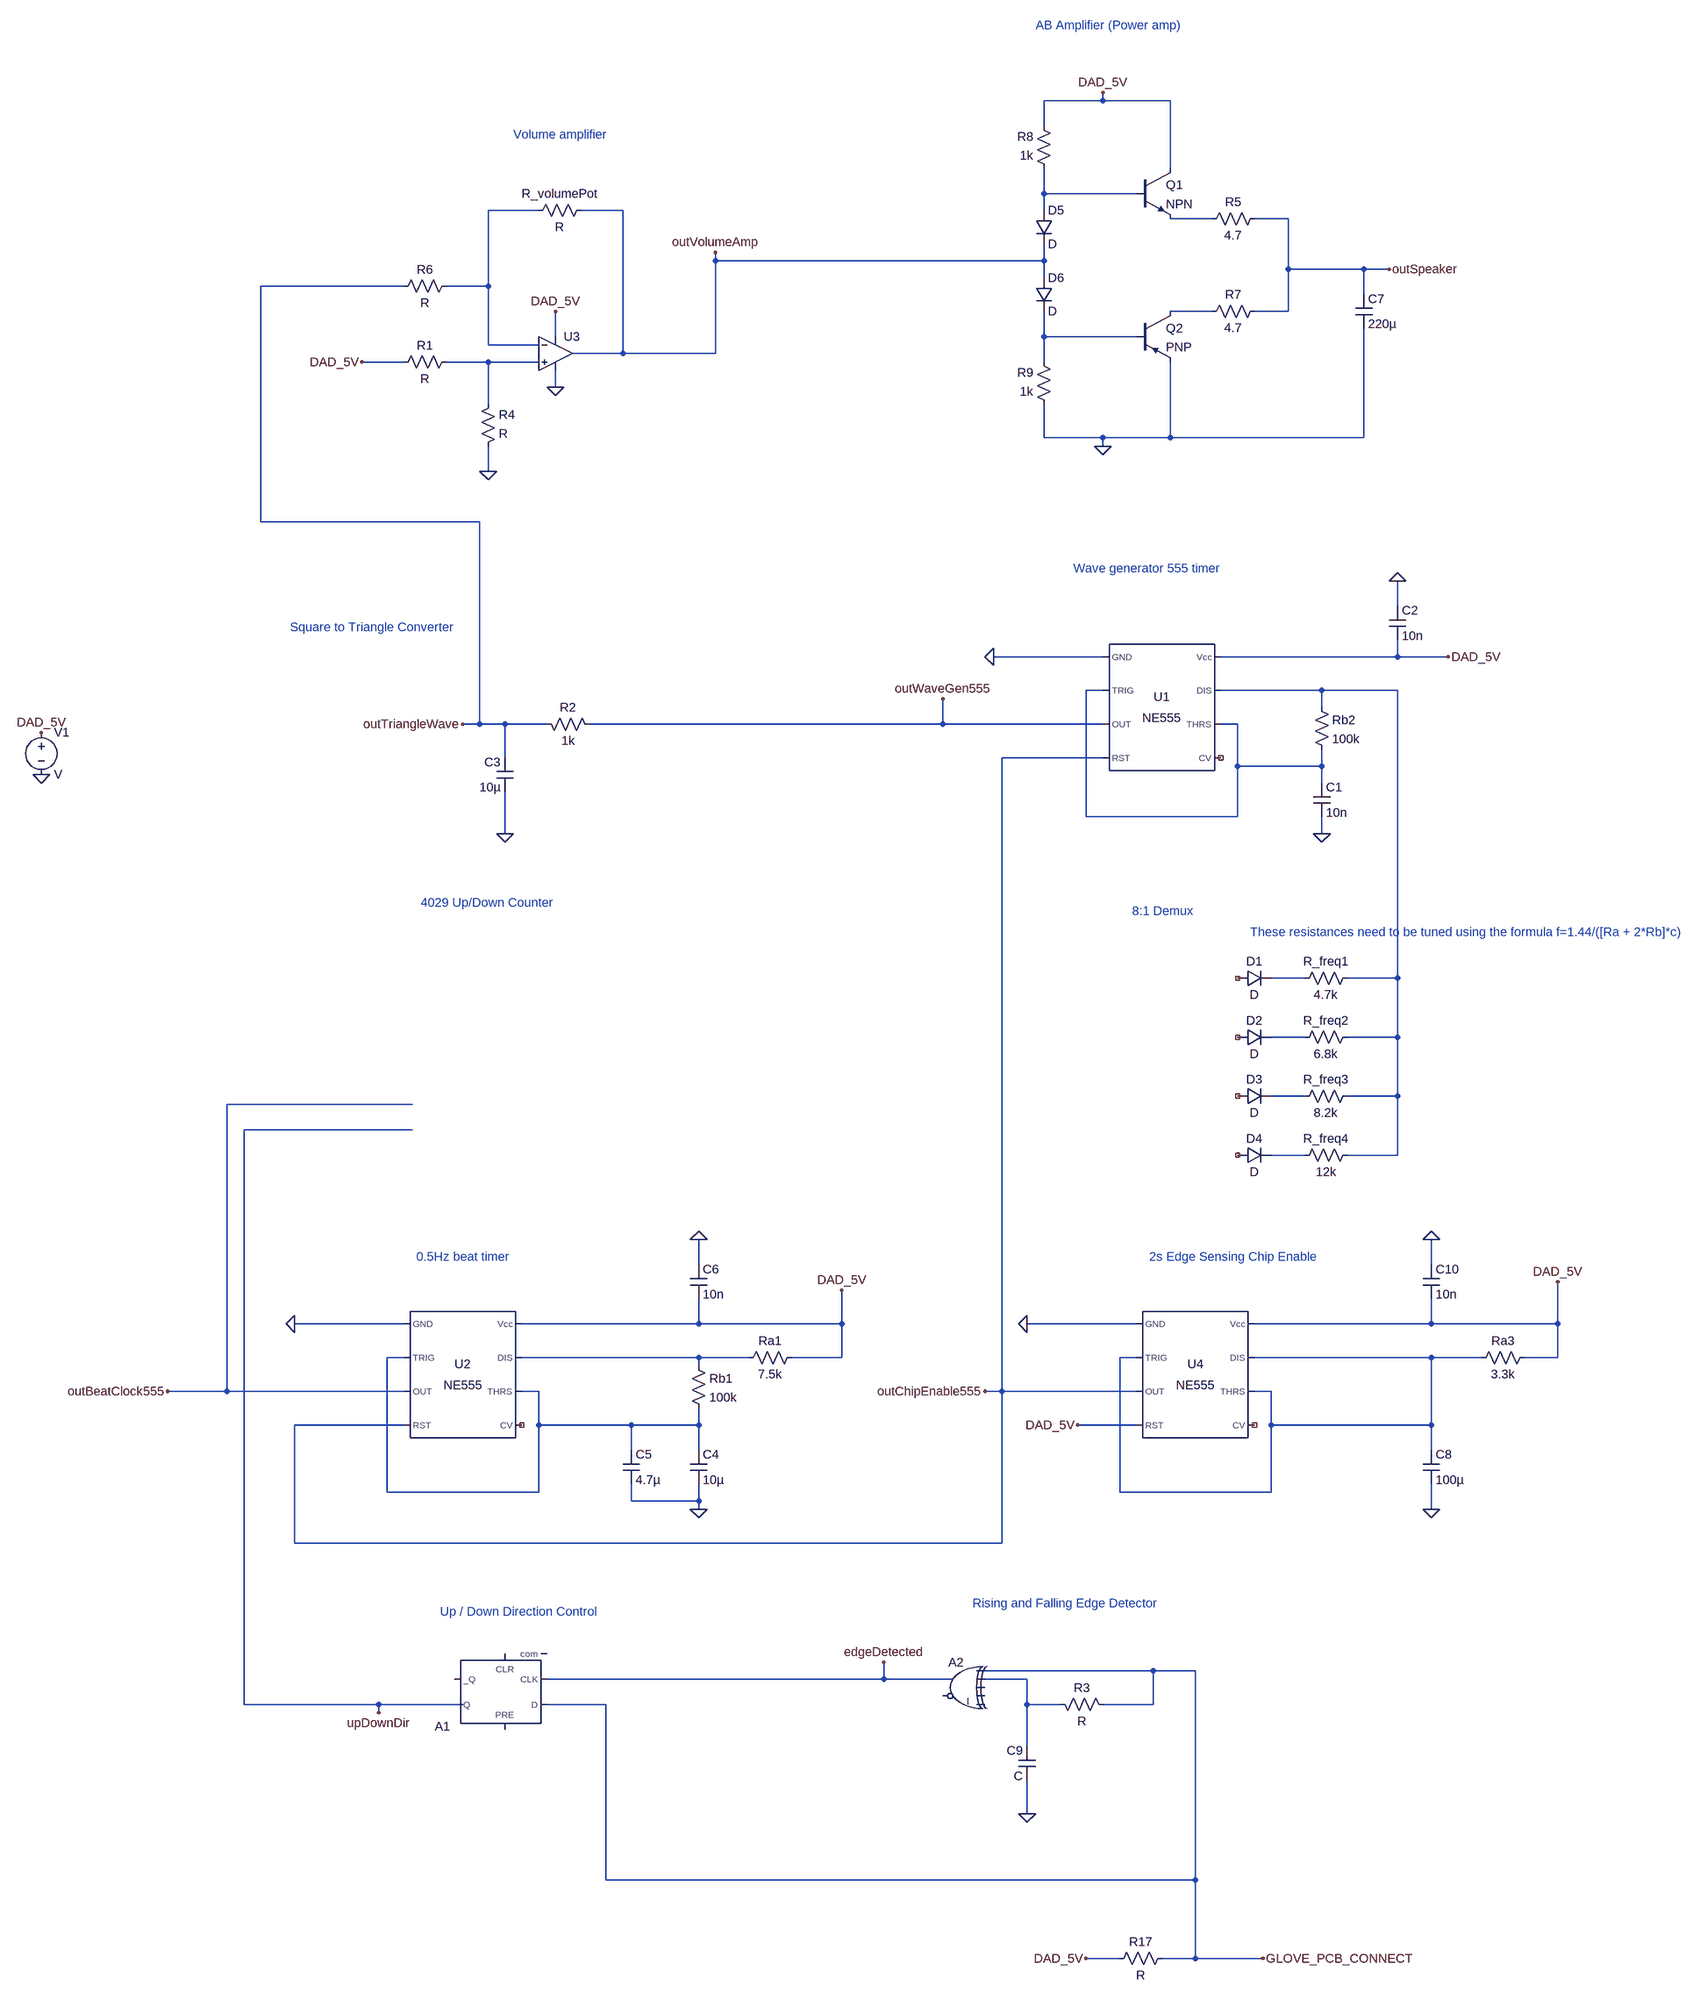
[diagram p0: schematic Wavegen and AB Amp.asc]
Wavegen and AB Amp.asc, the LTspice schematic file:
Version 4
SHEET 1 4340 4428
WIRE 1456 -1008 1456 -1024
WIRE 1456 -1008 1344 -1008
WIRE 1584 -1008 1456 -1008
WIRE 1344 -960 1344 -1008
WIRE 1584 -880 1584 -1008
WIRE 1344 -832 1344 -880
WIRE 1520 -832 1344 -832
WIRE 384 -800 288 -800
WIRE 544 -800 464 -800
WIRE 1344 -800 1344 -832
WIRE 1664 -784 1584 -784
WIRE 1808 -784 1744 -784
WIRE 720 -704 720 -720
WIRE 1344 -704 1344 -736
WIRE 1344 -704 720 -704
WIRE 1808 -688 1808 -784
WIRE 1952 -688 1808 -688
WIRE 2000 -688 1952 -688
WIRE 1344 -672 1344 -704
WIRE 128 -656 -144 -656
WIRE 288 -656 288 -800
WIRE 288 -656 208 -656
WIRE 1952 -640 1952 -688
WIRE 1664 -608 1584 -608
WIRE 1808 -608 1808 -688
WIRE 1808 -608 1744 -608
WIRE 416 -560 416 -608
WIRE 1344 -560 1344 -608
WIRE 1520 -560 1344 -560
WIRE 288 -544 288 -656
WIRE 384 -544 288 -544
WIRE 544 -528 544 -800
WIRE 544 -528 448 -528
WIRE 720 -528 720 -704
WIRE 720 -528 544 -528
WIRE 128 -512 48 -512
WIRE 288 -512 208 -512
WIRE 384 -512 288 -512
WIRE 1344 -512 1344 -560
WIRE 416 -464 416 -496
WIRE 288 -432 288 -512
WIRE 1344 -368 1344 -432
WIRE 1456 -368 1344 -368
WIRE 1584 -368 1584 -512
WIRE 1584 -368 1456 -368
WIRE 1952 -368 1952 -576
WIRE 1952 -368 1584 -368
WIRE 1456 -352 1456 -368
WIRE 288 -304 288 -352
WIRE -144 -208 -144 -656
WIRE 272 -208 -144 -208
WIRE 2016 -48 2016 -96
WIRE 1456 48 1248 48
WIRE 2016 48 2016 16
WIRE 2016 48 1680 48
WIRE 2112 48 2016 48
WIRE 1456 112 1424 112
WIRE 1872 112 1680 112
WIRE 2016 112 1872 112
WIRE 1872 144 1872 112
WIRE 272 176 272 -208
WIRE 272 176 240 176
WIRE 320 176 272 176
WIRE 400 176 320 176
WIRE 1152 176 1152 128
WIRE 1152 176 480 176
WIRE 1456 176 1152 176
WIRE 1712 176 1680 176
WIRE 320 240 320 176
WIRE 1456 240 1264 240
WIRE 1712 256 1712 176
WIRE 1872 256 1872 224
WIRE 1872 256 1712 256
WIRE 1872 288 1872 256
WIRE 1424 352 1424 112
WIRE 1712 352 1712 256
WIRE 1712 352 1424 352
WIRE 320 384 320 304
WIRE 1872 384 1872 352
WIRE 1840 752 1776 752
WIRE 2016 752 2016 112
WIRE 2016 752 1920 752
WIRE 1840 864 1776 864
WIRE 2016 864 2016 752
WIRE 2016 864 1920 864
WIRE 1840 976 1776 976
WIRE 2016 976 2016 864
WIRE 2016 976 1920 976
WIRE 144 992 -208 992
WIRE 144 1040 -176 1040
WIRE 1840 1088 1776 1088
WIRE 2016 1088 2016 976
WIRE 2016 1088 1920 1088
WIRE 688 1360 688 1312
WIRE 2080 1360 2080 1312
WIRE 128 1472 -80 1472
WIRE 688 1472 688 1424
WIRE 688 1472 352 1472
WIRE 960 1472 960 1408
WIRE 960 1472 688 1472
WIRE 1520 1472 1312 1472
WIRE 2080 1472 2080 1424
WIRE 2080 1472 1744 1472
WIRE 2320 1472 2320 1392
WIRE 2320 1472 2080 1472
WIRE 128 1536 96 1536
WIRE 688 1536 352 1536
WIRE 784 1536 688 1536
WIRE 960 1536 960 1472
WIRE 960 1536 864 1536
WIRE 1520 1536 1488 1536
WIRE 2080 1536 1744 1536
WIRE 2176 1536 2080 1536
WIRE 2320 1536 2320 1472
WIRE 2320 1536 2256 1536
WIRE 688 1552 688 1536
WIRE -208 1600 -208 992
WIRE -208 1600 -336 1600
WIRE 128 1600 -208 1600
WIRE 384 1600 352 1600
WIRE 1264 1600 1264 240
WIRE 1264 1600 1232 1600
WIRE 1520 1600 1264 1600
WIRE 1776 1600 1744 1600
WIRE 128 1664 -80 1664
WIRE 384 1664 384 1600
WIRE 560 1664 384 1664
WIRE 688 1664 688 1632
WIRE 688 1664 560 1664
WIRE 1520 1664 1408 1664
WIRE 1776 1664 1776 1600
WIRE 2080 1664 2080 1536
WIRE 2080 1664 1776 1664
WIRE 560 1712 560 1664
WIRE 688 1712 688 1664
WIRE 2080 1712 2080 1664
WIRE 96 1792 96 1536
WIRE 384 1792 384 1664
WIRE 384 1792 96 1792
WIRE 1488 1792 1488 1536
WIRE 1776 1792 1776 1664
WIRE 1776 1792 1488 1792
WIRE 560 1808 560 1776
WIRE 688 1808 688 1776
WIRE 688 1808 560 1808
WIRE 688 1824 688 1808
WIRE 2080 1824 2080 1776
WIRE -80 1888 -80 1664
WIRE 1264 1888 1264 1600
WIRE 1264 1888 -80 1888
WIRE 1552 2224 1232 2224
WIRE 1632 2224 1552 2224
WIRE 1040 2240 1040 2208
WIRE 1040 2240 400 2240
WIRE 1168 2240 1040 2240
WIRE 1312 2240 1232 2240
WIRE -176 2288 -176 1040
WIRE 80 2288 -176 2288
WIRE 240 2288 80 2288
WIRE 512 2288 400 2288
WIRE 1312 2288 1312 2240
WIRE 1376 2288 1312 2288
WIRE 1552 2288 1552 2224
WIRE 1552 2288 1456 2288
WIRE 80 2304 80 2288
WIRE 1312 2368 1312 2288
WIRE 1312 2496 1312 2432
WIRE 512 2768 512 2288
WIRE 1632 2768 1632 2224
WIRE 1632 2768 512 2768
WIRE 1488 2944 1424 2944
WIRE 1632 2944 1632 2768
WIRE 1632 2944 1568 2944
WIRE 1760 2944 1632 2944
FLAG 1152 128 outWaveGen555
FLAG -576 272 0
FLAG -576 192 DAD_5V
FLAG 1248 48 0
FLAG 2112 48 DAD_5V
FLAG 2016 -96 0
FLAG 1872 384 0
FLAG 320 384 0
FLAG 240 176 outTriangleWave
FLAG 688 1824 0
FLAG -336 1600 outBeatClock555
FLAG -80 1472 0
FLAG 960 1408 DAD_5V
FLAG 688 1312 0
FLAG 416 -608 DAD_5V
FLAG 416 -464 0
FLAG 288 -304 0
FLAG 48 -512 DAD_5V
FLAG 720 -720 outVolumeAmp
FLAG 1456 -1024 DAD_5V
FLAG 1456 -352 0
FLAG 2000 -688 outSpeaker
FLAG 2080 1824 0
FLAG 1232 1600 outChipEnable555
FLAG 1312 1472 0
FLAG 2320 1392 DAD_5V
FLAG 2080 1312 0
FLAG 1408 1664 DAD_5V
FLAG 1424 2944 DAD_5V
FLAG 1760 2944 GLOVE_PCB_CONNECT
FLAG 80 2304 upDownDir
FLAG 1312 2496 0
FLAG 1040 2208 edgeDetected
SYMBOL Misc\\NE555 1568 144 R0
SYMATTR InstName U1
SYMBOL voltage -576 176 R0
SYMATTR InstName V1
SYMBOL res 1856 128 R0
SYMATTR InstName Rb2
SYMATTR Value 100k
SYMBOL cap 2000 -48 R0
SYMATTR InstName C2
SYMATTR Value 10n
SYMBOL cap 1856 288 R0
SYMATTR InstName C1
SYMATTR Value 10n
SYMBOL res 384 160 M90
WINDOW 0 0 56 VBottom 2
WINDOW 3 32 56 VTop 2
SYMATTR InstName R2
SYMATTR Value 1k
SYMBOL cap 336 240 M0
SYMATTR InstName C3
SYMATTR Value 10µ
SYMBOL res 1936 736 R90
WINDOW 0 0 56 VBottom 2
WINDOW 3 32 56 VTop 2
SYMATTR InstName R_freq1
SYMATTR Value 4.7k
SYMBOL res 1936 848 R90
WINDOW 0 0 56 VBottom 2
WINDOW 3 32 56 VTop 2
SYMATTR InstName R_freq2
SYMATTR Value 6.8k
SYMBOL res 1936 960 R90
WINDOW 0 0 56 VBottom 2
WINDOW 3 32 56 VTop 2
SYMATTR InstName R_freq3
SYMATTR Value 8.2k
SYMBOL res 1936 1072 R90
WINDOW 0 0 56 VBottom 2
WINDOW 3 32 56 VTop 2
SYMATTR InstName R_freq4
SYMATTR Value 12k
SYMBOL diode 1712 768 R270
WINDOW 0 32 32 VTop 2
WINDOW 3 0 32 VBottom 2
SYMATTR InstName D1
SYMBOL diode 1712 880 R270
WINDOW 0 32 32 VTop 2
WINDOW 3 0 32 VBottom 2
SYMATTR InstName D2
SYMBOL diode 1712 992 R270
WINDOW 0 32 32 VTop 2
WINDOW 3 0 32 VBottom 2
SYMATTR InstName D3
SYMBOL diode 1712 1104 R270
WINDOW 0 32 32 VTop 2
WINDOW 3 0 32 VBottom 2
SYMATTR InstName D4
SYMBOL Misc\\NE555 240 1568 R0
SYMATTR InstName U2
SYMBOL cap 672 1712 R0
SYMATTR InstName C4
SYMATTR Value 10µ
SYMBOL res 672 1536 R0
SYMATTR InstName Rb1
SYMATTR Value 100k
SYMBOL cap 544 1712 R0
SYMATTR InstName C5
SYMATTR Value 4.7µ
SYMBOL cap 672 1360 R0
SYMATTR InstName C6
SYMATTR Value 10n
SYMBOL OpAmps\\UniversalOpamp2 416 -528 R0
SYMATTR InstName U3
SYMBOL res 224 -528 R90
WINDOW 0 0 56 VBottom 2
WINDOW 3 32 56 VTop 2
SYMATTR InstName R1
SYMBOL res 272 -336 M180
WINDOW 0 36 76 Left 2
WINDOW 3 36 40 Left 2
SYMATTR InstName R4
SYMBOL res 480 -816 R90
WINDOW 0 0 56 VBottom 2
WINDOW 3 32 56 VTop 2
SYMATTR InstName R_volumePot
SYMBOL res 224 -672 R90
WINDOW 0 0 56 VBottom 2
WINDOW 3 32 56 VTop 2
SYMATTR InstName R6
SYMBOL npn 1520 -880 R0
SYMATTR InstName Q1
SYMBOL pnp 1520 -608 R0
SYMATTR InstName Q2
SYMBOL res 1760 -800 R90
WINDOW 0 0 56 VBottom 2
WINDOW 3 32 56 VTop 2
SYMATTR InstName R5
SYMATTR Value 4.7
SYMBOL res 1760 -624 R90
WINDOW 0 0 56 VBottom 2
WINDOW 3 32 56 VTop 2
SYMATTR InstName R7
SYMATTR Value 4.7
SYMBOL res 1360 -864 R180
WINDOW 0 36 76 Left 2
WINDOW 3 36 40 Left 2
SYMATTR InstName R8
SYMATTR Value 1k
SYMBOL res 1360 -416 R180
WINDOW 0 36 76 Left 2
WINDOW 3 36 40 Left 2
SYMATTR InstName R9
SYMATTR Value 1k
SYMBOL diode 1328 -800 R0
SYMATTR InstName D5
SYMBOL diode 1328 -672 R0
SYMATTR InstName D6
SYMBOL cap 1936 -640 R0
SYMATTR InstName C7
SYMATTR Value 220µ
SYMBOL Misc\\NE555 1632 1568 R0
SYMATTR InstName U4
SYMBOL cap 2064 1712 R0
SYMATTR InstName C8
SYMATTR Value 100µ
SYMBOL cap 2064 1360 R0
SYMATTR InstName C10
SYMATTR Value 10n
SYMBOL res 880 1520 R90
WINDOW 0 0 56 VBottom 2
WINDOW 3 32 56 VTop 2
SYMATTR InstName Ra1
SYMATTR Value 7.5k
SYMBOL res 2272 1520 R90
WINDOW 0 0 56 VBottom 2
WINDOW 3 32 56 VTop 2
SYMATTR InstName Ra3
SYMATTR Value 3.3k
SYMBOL res 1584 2928 R90
WINDOW 0 0 56 VBottom 2
WINDOW 3 32 56 VTop 2
SYMATTR InstName R17
SYMBOL Digital\\dflop 320 2336 R180
SYMATTR InstName A1
SYMBOL Digital\\xor 1184 2192 M0
SYMATTR InstName A2
SYMBOL res 1360 2272 M90
WINDOW 0 0 56 VBottom 2
WINDOW 3 32 56 VTop 2
SYMATTR InstName R3
SYMBOL cap 1328 2368 M0
SYMATTR InstName C9
TEXT 1400 -120 Left 2 ;Wave generator 555 timer
TEXT -88 -8 Left 2 ;Square to Triangle Converter
TEXT 152 1344 Left 2 ;0.5Hz beat timer
TEXT 1736 664 Left 2 ;These resistances need to be tuned using the formula f=1.44/([Ra + 2*Rb]*c)
TEXT 1512 624 Left 2 ;8:1 Demux
TEXT 160 608 Left 2 ;4029 Up/Down Counter
TEXT 336 -944 Left 2 ;Volume amplifier
TEXT 1328 -1152 Left 2 ;AB Amplifier (Power amp)
TEXT 1544 1344 Left 2 ;2s Edge Sensing Chip Enable
TEXT 496 2112 Right 2 ;Up / Down Direction Control
TEXT 1208 2096 Left 2 ;Rising and Falling Edge Detector

The netlist it stands for:
* Wavegen and AB Amp.asc
XU1 0 N007 outWaveGen555 outChipEnable555 NC_01 N007 N008 DAD_5V NE555  ; pins GND TRIG OUT RST CV THRS DIS Vcc
V1 DAD_5V 0 V
Rb2 N008 N007 100k
C2 0 DAD_5V 10n
C1 N007 0 10n
R2 outTriangleWave outWaveGen555 1k
C3 outTriangleWave 0 10µ
R_freq1 N008 N009 4.7k
R_freq2 N008 N010 6.8k
R_freq3 N008 N011 8.2k
R_freq4 N008 N012 12k
D1 NC_02 N009 D
D2 NC_03 N010 D
D3 NC_04 N011 D
D4 NC_05 N012 D
XU2 0 N013 outBeatClock555 outChipEnable555 NC_06 N013 N014 DAD_5V NE555  ; pins GND TRIG OUT RST CV THRS DIS Vcc
C4 N013 0 10µ
Rb1 N014 N013 100k
C5 N013 0 4.7µ
C6 0 DAD_5V 10n
XU3 N006 N002 DAD_5V 0 outVolumeAmp level.2 Avol=1Meg GBW=10Meg Slew=10Meg ilimit=25m rail=0 Vos=0 phimargin=45 en=0 enk=0 in=0 ink=0 Rin=500Meg  ; pins IN+ IN- V+ V- OUT
R1 N006 DAD_5V R
R4 0 N006 R
R_volumePot outVolumeAmp N002 R
R6 N002 outTriangleWave R
Q1 DAD_5V N001 N003 0 NPN
Q2 N004 N005 0 0 PNP
R5 outSpeaker N003 4.7
R7 outSpeaker N004 4.7
R8 N001 DAD_5V 1k
R9 0 N005 1k
D5 N001 outVolumeAmp D
D6 outVolumeAmp N005 D
C7 outSpeaker 0 220µ
XU4 0 N015 outChipEnable555 DAD_5V NC_07 N015 N015 DAD_5V NE555  ; pins GND TRIG OUT RST CV THRS DIS Vcc
C8 N015 0 100µ
C10 0 DAD_5V 10n
Ra1 DAD_5V N014 7.5k
Ra3 DAD_5V N015 3.3k
R17 GLOVE_PCB_CONNECT DAD_5V R
A1 GLOVE_PCB_CONNECT 0 edgeDetected 0 0 0 upDownDir 0 DFLOP
A2 GLOVE_PCB_CONNECT N016 0 0 0 0 edgeDetected 0 XOR
R3 N016 GLOVE_PCB_CONNECT R
C9 N016 0 C
.model D D
.lib standard.dio
.model NPN NPN
.model PNP PNP
.lib standard.bjt
* Wave generator 555 timer
* Square to Triangle Converter
* 0.5Hz beat timer
* These resistances need to be tuned using the formula f=1.44/([Ra + 2*Rb]*c)
* 8:1 Demux
* 4029 Up/Down Counter
* Volume amplifier
* AB Amplifier (Power amp)
* 2s Edge Sensing Chip Enable
* Up / Down Direction Control
* Rising and Falling Edge Detector
.lib NE555.sub
.lib UniversalOpamps2.sub
.backanno
.end